# Altium schematic sheet 3V3Supply.SchDoc
size A
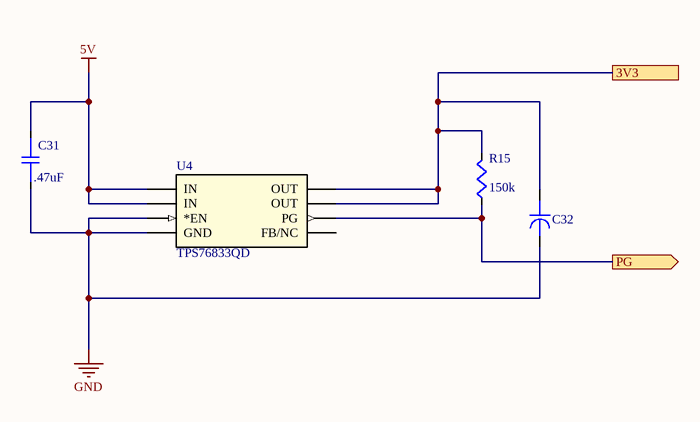
[diagram p0: 3V3Supply.SchDoc]

## Parts
C31  .47uF  [C0603]
C32  22UF TANT  [CAP_293D_D_VIS]  (value not drawn)
R15  150k  [R0603]
U4  TPS76833QD  [D8_TEX]

## Ports
3V3, PG (out)

## Nets
5V: C31.2 U4.3(IN) U4.4(IN)
GND: C31.1 C32.1 U4.1(GND) U4.2(*EN)
3V3: C32.2 R15.2 U4.5(OUT) U4.6(OUT) ; port 3V3
PG: R15.1 U4.8(PG) ; port PG

Not connected (* = marked no-connect by the designer): U4 7(FB/NC)

## Library data of the parts
C31 = C0603C474J4RACAUTO: KEMET - C0603C474J4RACAUTO - CAP, 0.47µF, 16V, 5%, X7R, 0603; Capacitance: 470nF; Supplier 1: Digi-Key; Supplier Part Number 1: 399-17596-1-ND; Manufacturer 1: KEMET; Manufacturer Part Number 1: C0603C474J4RACAUTO; Stock 1: 10040; Pricing 1: 1=0.51000, 10=0.35800, 100=0.23570, 500=0.17462, 1000=0.14842 (USD); RoHS: Yes; Case/Package: 0603; Min Operating Temperature: -55°C; Max Operating Temperature: 125°C; Dielectric: X7R; Tolerance: 5%; Packaging: Tape and Reel; Length: 1.6mm; Depth: 0.8mm; ComponentLink1URL: http://www.farnell.com/datasheets/2749769.pdf?src-supplier=Farnell; ComponentLink1Description: http://www.farnell.com/datasheets/2749769.pdf?src-supplier=Farnell; ComponentLink2URL: http://components.arrow.com/part/dataview/0323_07310140?src-supplier=Arrow+Europe; ComponentLink2Description: http://components.arrow.com/part/dataview/0323_07310140?src-supplier=Arrow+Europe; ComponentLink3URL: https://api.kemet.com/component-edge/download/datasheet/C0603C474J4RACAUTO.pdf?src-supplier=Digi-Key; ComponentLink3Description: https://api.kemet.com/component-edge/download/datasheet/C0603C474J4RACAUTO.pdf?src-supplier=Digi-Key; ComponentLink4URL: http://www.farnell.com/datasheets/2749769.pdf?src-supplier=Element14; ComponentLink4Description: http://www.farnell.com/datasheets/2749769.pdf?src-supplier=Element14; ComponentLink5URL: http://www.farnell.com/datasheets/2749769.pdf?src-supplier=Newark; ComponentLink5Description: http://www.farnell.com/datasheets/2749769.pdf?src-supplier=Newark
C32 = 293D226X9035D2TE3: CAP TANT 22UF 10% 35V 2917; Manufacturer 1: Vishay Sprague; Dielectric Material: Tantalum; ESR (Equivalent Series Resistance): 600mR; Polarity: Polar; Ripple Current: 500mA; Dissipation Factor: 6%; Voltage Rating (DC): 300kV; Leakage Current: 7.7uA; Supplier 1: Digi-Key; Supplier Part Number 1: 718-1071-1-ND; Manufacturer Part Number 1: 293D226X9035D2TE3; RoHS: Yes; Category: Tantalum Capacitors; Stock 1: 31; Pricing 1: 1=1.00000, 10=0.78800, 50=0.68260, 100=0.59060 (USD); Mount: Surface Mount,PCB; Case/Package: 2917; Case Code (Imperial): 2917; Case Code (Metric): 7343; Weight: 0.023634oz; Min Operating Temperature: -55°C; Max Operating Temperature: 125°C; Capacitance: 22uF; Tolerance: 10%; Voltage: 35V; Voltage Rating: 35V; Packaging: Tape and Reel; Package Quantity: 1; Termination: SMD/SMT; Features: General Purpose; Length: 7.3mm; Width: 2.8mm; Height: 2.8mm; Depth: 4.3mm; Height - Seated (Max): 0.122inch; Radiation Hardening: No; Lead Free: Lead Free; REACH SVHC: Unknown; ComponentLink1URL: https://datasheet.ciiva.com/11793/0900766b80d97b37-11793792.pdf?src-supplier=RSComponents; ComponentLink1Description: https://datasheet.ciiva.com/11793/0900766b80d97b37-11793792.pdf?src-supplier=RSComponents; ComponentLink2URL: https://datasheet.ciiva.com/3003/293d-3003938.pdf?src-supplier=Avnet; ComponentLink2Description: https://datasheet.ciiva.com/3003/293d-3003938.pdf?src-supplier=Avnet; ComponentLink3URL: https://datasheet.ciiva.com/16357/293d-16357928.pdf?src-supplier=Future+Electronics; ComponentLink3Description: https://datasheet.ciiva.com/16357/293d-16357928.pdf?src-supplier=Future+Electronics; ComponentLink4URL: https://datasheet.ciiva.com/22695/438417-22695144.pdf?src-supplier=Element14; ComponentLink4Description: https://datasheet.ciiva.com/22695/438417-22695144.pdf?src-supplier=Element14; ComponentLink5URL: https://datasheet.ciiva.com/260/293d-260029.pdf?src-supplier=Digi-Key; ComponentLink5Description: https://datasheet.ciiva.com/260/293d-260029.pdf?src-supplier=Digi-Key; ComponentLink6URL: https://datasheet.ciiva.com/260/293d-260031.pdf?src-supplier=Digi-Key; ComponentLink6Description: https://datasheet.ciiva.com/260/293d-260031.pdf?src-supplier=Digi-Key; ComponentLink7URL: https://datasheet.ciiva.com/1463/438417-1463353.pdf?src-supplier=Element14; ComponentLink7Description: https://datasheet.ciiva.com/1463/438417-1463353.pdf?src-supplier=Element14; ComponentLink8URL: https://datasheet.ciiva.com/260/293d-260030.pdf?src-supplier=Digi-Key; ComponentLink8Description: https://datasheet.ciiva.com/260/293d-260030.pdf?src-supplier=Digi-Key
R15 = CRGCQ0603F150K: CRGCQ 0603 150K 1%; Manufacturer 1: Yageo; Manufacturer Part Number 1: RC0603JR-0710KL; Resistance: 10kR; Tolerance: 5%; Temperature Coefficient: 100ppm/°C; Voltage Rating (DC): 50V; Power Rating: 100mW; Supplier 1: Digi-Key; Stock 1: 22910838; Pricing 1: 1=0.10000, 10=0.01700, 100=0.00710, 1000=0.00318, 2500=0.00276 (USD); RoHS: Yes; Case/Package: 0603; Number of Pins: 2; Contact Plating: Tin,Matte; Case Code (Imperial): 0603; Case Code (Metric): 1608; Min Operating Temperature: -55°C; Max Operating Temperature: 155°C; Composition: Thick Film; Packaging: Tape and Reel; Voltage Rating: 50V; Termination: SMD/SMT; Military Standard: Not; Length: 1.6mm; Width: 0.8mm; Depth: 0.8mm; Radiation Hardening: No; REACH SVHC: Unknown; Lead Free: Lead Free; ComponentLink1URL: https://datasheet.ciiva.com/2452/pyu-rc0603-51-rohs-l-4-2452848.pdf?src-supplier=Digi-Key; ComponentLink1Description: https://datasheet.ciiva.com/2452/pyu-rc0603-51-rohs-l-4-2452848.pdf?src-supplier=Digi-Key; ComponentLink2URL: https://datasheet.ciiva.com/7746/443971-7746427.pdf?src-supplier=Element14; ComponentLink2Description: https://datasheet.ciiva.com/7746/443971-7746427.pdf?src-supplier=Element14; ComponentLink3URL: https://datasheet.ciiva.com/22747/443971-22747531.pdf?src-supplier=Element14; ComponentLink3Description: https://datasheet.ciiva.com/22747/443971-22747531.pdf?src-supplier=Element14; ComponentLink4URL: https://datasheet.ciiva.com/7746/443971-7746428.pdf?src-supplier=Element14; ComponentLink4Description: https://datasheet.ciiva.com/7746/443971-7746428.pdf?src-supplier=Element14; ComponentLink5URL: https://datasheet.ciiva.com/15189/getdatasheetpartid-327958-15189847.pdf?src-supplier=Verical; ComponentLink5Description: https://datasheet.ciiva.com/15189/getdatasheetpartid-327958-15189847.pdf?src-supplier=Verical; ComponentLink6URL: https://datasheet.ciiva.com/8883/pyu-rc0603-51-rohs-l-4-8883049.pdf?src-supplier=Avnet; ComponentLink6Description: https://datasheet.ciiva.com/8883/pyu-rc0603-51-rohs-l-4-8883049.pdf?src-supplier=Avnet; Supplier Part Number 1: 311-10KGRCT-ND
U4 = TPS76833QD: 3.3V Linear Voltage Regulator IC 1 Output 1A 8-SOIC; Vendor: Texas Instruments; Built_By: EMA_UL_Team; SourceLibrary: TI_2011-12-14_2; Manufacturer_Part_Number: TPS76833QD; Copyright: Copyright (C) 2018 Accelerated Designs. All rights reserved; RefDes: RefDes; Type: DEV